# EAGLE design Schalter-UB-HF-Verst2_2 (EAGLE 6.2)
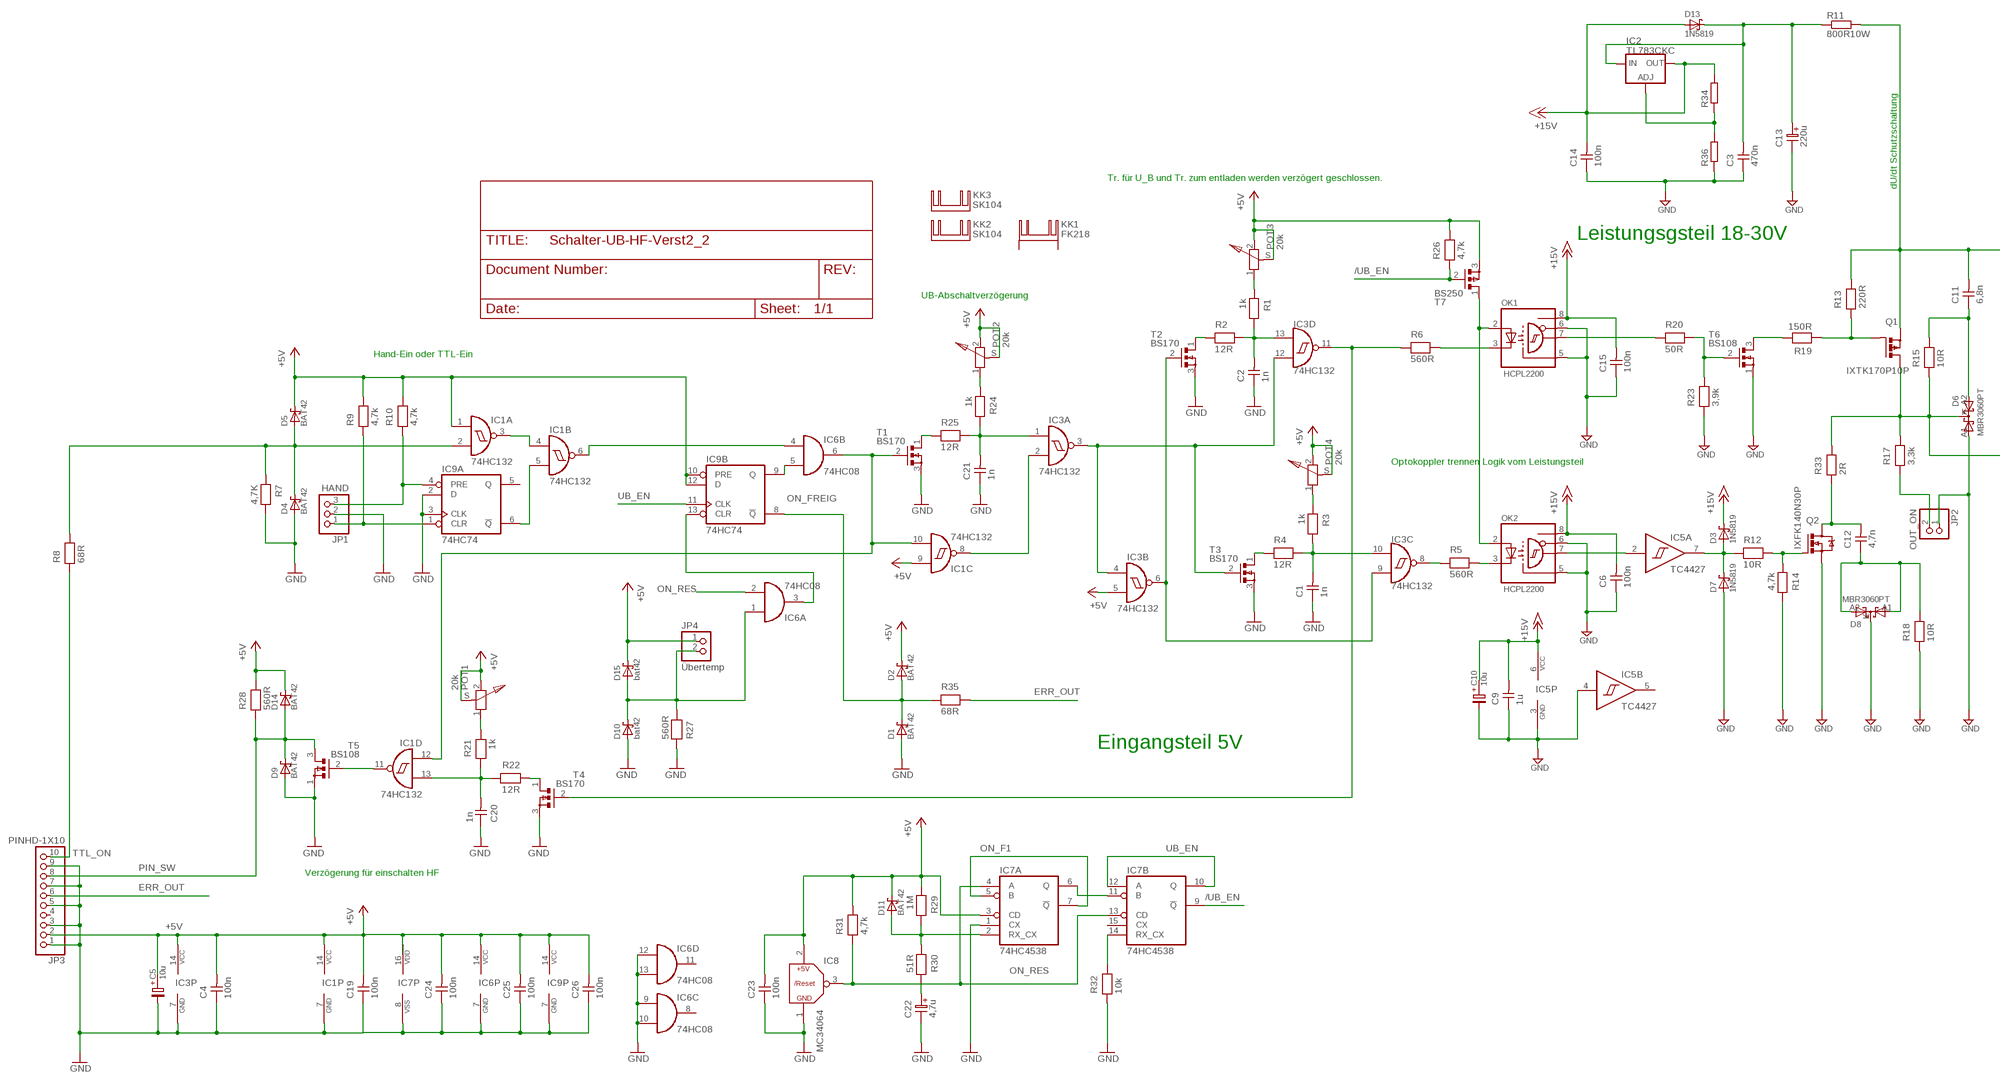
[diagram p0: schematic, sheet 1, part 1 of 2]
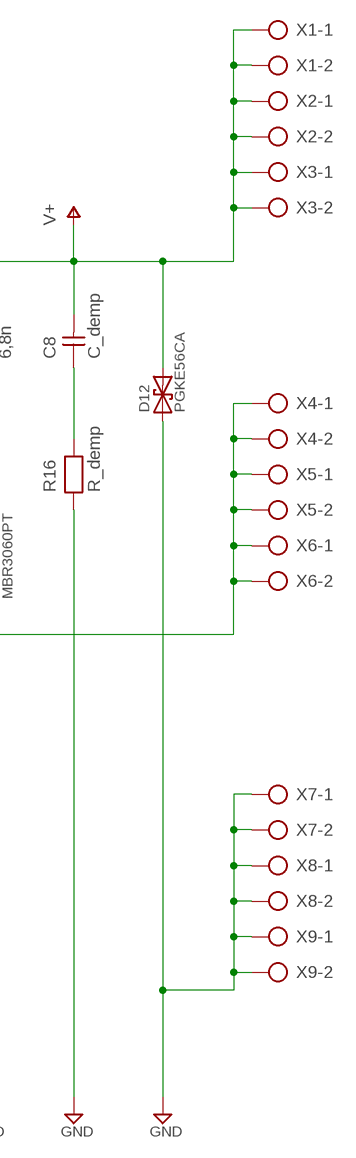
[diagram p1: schematic, sheet 1, part 2 of 2]

## Parts
C1  1n  CAPNP-2,5  [C-2,5]
C2  1n  CAPNP-2,5  [C-2,5]
C3  470n  CAPNP-5  [C-5]
C4  100n  CAPNP-2,5  [C-2,5]
C5  10u  B45181A  [B45181A]
C6  100n  CAPNP-2,5  [C-2,5]
C8  C_demp  CAPNP-7,5  [C-7,5]
C9  1u  CAPNP-5  [C-5]
C10  10u  B45181A  [B45181A]
C11  6,8n  CAPNP-10  [C-10]
C12  4,7n  CAPNP-10  [C-10]
C13  220u  ELC-5  [ES-5]
C14  100n  CAPNP-2,5  [C-2,5]
C15  100n  CAPNP-2,5  [C-2,5]
C19  100n  CAPNP-2,5  [C-2,5]
C20  1n  CAPNP-2,5  [C-2,5]
C21  1n  CAPNP-2,5  [C-2,5]
C22  4,7u  ELC-2,5  [ES-2,5]
C23  100n  CAPNP-2,5  [C-2,5]
C24  100n  CAPNP-2,5  [C-2,5]
C25  100n  CAPNP-2,5  [C-2,5]
C26  100n  CAPNP-2,5  [C-2,5]
D1  BAT42  SCHOTTKY-5  [D-5]
D2  BAT42  SCHOTTKY-5  [D-5]
D3  1N5819  1N5919  [F-126-10]
D4  BAT42  SCHOTTKY-5  [D-5]
D5  BAT42  SCHOTTKY-5  [D-5]
D6  MBR3060PT  PBYR6045  [SOT93S]
D7  1N5819  1N5919  [F-126-10]
D8  MBR3060PT  PBYR3035  [SOT93S]
D9  BAT42  SCHOTTKY-5  [D-5]
D10  bat42  SCHOTTKY-5  [D-5]
D11  BAT42  SCHOTTKY-5  [D-5]
D12  PGKE56CA  P6KEXXC  [CB417-15]
D13  1N5819  [F126-10]
D14  BAT42  SCHOTTKY-5  [D-5]
D15  bat42  SCHOTTKY-5  [D-5]
IC1  74HC132  74132  [DIL14]
IC2  TL783CKC  LM138-TS  [TO220S]
IC3  74HC132  74132  [DIL14]
IC5  TC4427  [DIL08]
IC6  74HC08  7408  [DIL14]
IC7  74HC4538  4538  [DIL16]
IC8  MC34064  TL7757  [TO92]
IC9  74HC74  7474  [DIL14]
JP1  HAND  PINHD-1X3  [1X03]
JP2  OUT_ON  PINHD-1X2  [1X02]
JP3  PINHD-1X10  [1X10]
JP4  Übertemp  PINHD-1X2  [1X02]
KK1  FK218  [FK218]
KK2  SK104  [SK104]
KK3  SK104  [SK104]
OK1  HCPL2200  [DIL08]
OK2  HCPL2200  [DIL08]
POT1  20k  POT-10-SI  [PT-10-SI]
POT2  20k  POT-10-SI  [PT-10-SI]
POT3  20k  POT-10-SI  [PT-10-SI]
POT4  20k  POT-10-SI  [PT-10-SI]
Q1  IXTK170P10P  PMOSFET_PTO220BV  [TO220BV]
Q2  IXFK140N30P  IRFPC40  [TO247BV]
R1  1k  RESEU-7,5  [R-7,5]
R2  12R  RESEU-7,5  [R-7,5]
R3  1k  RESEU-7,5  [R-7,5]
R4  12R  RESEU-7,5  [R-7,5]
R5  560R  RESEU-7,5  [R-7,5]
R6  560R  RESEU-7,5  [R-7,5]
R7  4,7K  RESEU-7,5  [R-7,5]
R8  68R  RESEU-7,5  [R-7,5]
R9  4,7k  RESEU-7,5  [R-7,5]
R10  4,7k  RESEU-7,5  [R-7,5]
R11  800R10W  R-EU_0817/7V  [P0817V]
R12  10R  RESEU-7,5  [R-7,5]
R13  220R  RESEU-25  [R25]
R14  4,7k  RESEU-7,5  [R-7,5]
R15  10R  RESEU-12,5  [R-12,5]
R16  R_demp  RESEU-12,5  [R-12,5]
R17  3,3k  RESEU-12,5  [R-12,5]
R18  10R  RESEU-12,5  [R-12,5]
R19  150R  RESEU-12,5  [R-12,5]
R20  50R  RESEU-7,5  [R-7,5]
R21  1k  RESEU-7,5  [R-7,5]
R22  12R  RESEU-7,5  [R-7,5]
R23  3,9k  RESEU-7,5  [R-7,5]
R24  1k  RESEU-7,5  [R-7,5]
R25  12R  RESEU-7,5  [R-7,5]
R26  4,7k  RESEU-7,5  [R-7,5]
R27  560R  RESEU-7,5  [R-7,5]
R28  560R  RESEU-7,5  [R-7,5]
R29  1M  RESEU-7,5  [R-7,5]
R30  51R  RESEU-7,5  [R-7,5]
R31  4,7k  RESEU-S2,5  [RS-2,5]
R32  10k  RESEU-7,5  [R-7,5]
R33  2R  R-TO220  [R-TO220]
R34  R-EU_0204/7  [0204/7]
R35  68R  RESEU-7,5  [R-7,5]
R36  R-EU_0204/7  [0204/7]
T1  BS170  [TO-92]
T2  BS170  [TO-92]
T3  BS170  [TO-92]
T4  BS170  [TO-92]
T5  BS108  [TO92-]
T6  BS108  [TO92-]
T7  BS250  [TO-92]
X1  AK500/2  [AK500/2]
X2  AK500/2  [AK500/2]
X3  AK500/2  [AK500/2]
X4  AK500/2  [AK500/2]
X5  AK500/2  [AK500/2]
X6  AK500/2  [AK500/2]
X7  AK500/2  [AK500/2]
X8  AK500/2  [AK500/2]
X9  AK500/2  [AK500/2]

## Nets
+5V: C4.2 C5.+ C19.2 C23.2 C24.2 C25.2 C26.2 D2.2(K) D5.2(K) D11.2(K) D14.2(K) D15.2(K) IC1.1(A:I0) IC1.9(C:I0) IC1.14(P:VCC) IC3.5(B:I1) IC3.14(P:VCC) IC6.14(P:VCC) IC7.3(A:CD) IC7.16(P:VDD) IC8.2(+5V) IC9.10(B:PRE) IC9.12(B:D) IC9.14(P:VCC) JP3.2 JP4.1 POT1.2 POT1.S POT2.2 POT2.S POT3.2 POT3.S POT4.2 POT4.S R9.2 R10.2 R26.2 R28.2 R29.1 R31.2 T7.3(S)
+15V: C6.2 C9.2 C10.+ C14.2 C15.2 D3.K D13.A IC2.2(OUT) IC5.6(P:VCC) OK1.8(VCC) OK2.8(VCC) R34.2
/UB_EN: IC7.9(B:!Q) R26.1 T7.2(G)
ERR_OUT: JP3.6 R35.2
GND: C1.1 C2.1 C4.1 C5.- C19.1 C20.1 C21.1 C22.2 C23.1 C24.1 C25.1 C26.1 D1.1(A) D4.1(A) D9.1(A) D10.1(A) IC1.7(P:GND) IC3.7(P:GND) IC6.7(P:GND) IC6.9(C:I0) IC6.10(C:I1) IC6.12(D:I0) IC6.13(D:I1) IC7.1(A:CX) IC7.8(P:VSS) IC8.1(GND) IC9.2(A:D) IC9.3(A:CLK) IC9.7(P:GND) JP1.2 JP3.1 JP3.3 JP3.5 JP3.7 JP3.9 R7.2 R27.1 R32.1 T1.3(S) T2.3(S) T3.3(S) T4.3(S) T5.1(S)
GND-PWR: C3.1 C6.1 C9.1 C10.- C13.2 C14.1 C15.1 D6.A1 D7.A D8.K D12.A IC5.3(P:GND) IC5.4(B:I) JP2.1 OK1.5(GND) OK1.6(VE) OK2.5(GND) OK2.6(VE) Q2.S R14.2 R16.1 R18.1 R23.1 R36.1 T6.1(S) X7.1 X7.2 X8.1 X8.2 X9.1 X9.2 ; supply symbol labelled GND
HAND_OFF: IC9.4(A:PRE) JP1.3 R10.1
HAND_ON: IC9.1(A:CLR) JP1.1 R9.1
N$1: C1.2 IC3.10(C:I1) R3.2 R4.2
N$2: IC3.6(B:O) IC3.9(C:I0) T2.2(G)
N$3: R2.1 T2.1(D)
N$4: C2.2 IC3.13(D:I1) R1.2 R2.2
N$5: IC1.3(A:O) IC1.4(B:I0)
N$6: IC6.3(A:O) IC9.13(B:CLR)
N$7: R4.1 T3.1(D)
N$8: IC2.1(ADJ) R34.1 R36.2
N$9: OK1.3(K) R6.2
N$10: IC3.11(D:O) R6.1 T4.2(G)
N$11: OK2.3(K) R5.2
N$12: IC3.8(C:O) R5.1
N$13: D3.A D7.K IC5.7(A:O) R12.1
N$14: D1.2(K) D2.1(A) IC9.8(B:!Q) R35.1
N$15: D4.2(K) D5.1(A) IC1.2(A:I1) R7.1 R8.2
N$16: IC1.6(B:O) IC6.4(B:I0)
N$17: Q2.G R12.2 R14.1
N$18: C8.1 R16.2
N$19: JP2.2 R17.1
N$20: POT3.1 R1.1
N$21: IC1.11(D:O) T5.2(G)
N$22: R20.2 R23.2 T6.2(G)
N$24: IC5.2(A:I) OK2.7(VO)
N$25: C20.2 IC1.13(D:I1) R21.2 R22.2
N$26: Q1.G R13.1 R19.1
N$27: C11.1 D6.A2 R15.2
N$30: R19.2 T6.3(D)
N$31: C12.2 Q2.D R33.1
N$32: POT4.1 R3.1
N$33: C12.1 D8.A1 D8.A2 R18.2
N$34: IC1.8(C:O) IC3.2(A:I1)
N$35: IC3.3(A:O) IC3.4(B:I0) IC3.12(D:I0) T3.2(G)
N$36: IC1.5(B:I1) IC9.6(A:!Q)
N$37: IC1.10(C:I1) IC1.12(D:I0) IC6.6(B:O) T1.2(G)
N$38: R22.1 T4.1(D)
N$39: OK1.7(VO) R20.1
N$40: POT2.1 R24.1
N$41: C21.2 IC3.1(A:I0) R24.2 R25.2
N$42: R25.1 T1.1(D)
N$43: IC7.6(A:Q) IC7.11(B:B)
N$44: OK1.2(A) OK2.2(A) T7.1(D)
N$45: POT1.1 R21.1
N$46: C22.1 R30.2
N$47: D11.1(A) IC7.2(A:RX_CX) R29.2 R30.1
N$48: IC7.14(B:RX_CX) R32.2
ON_F1: IC7.5(A:B) IC7.7(A:!Q)
ON_FREIG: IC6.5(B:I1) IC9.9(B:Q)
ON_RES: IC6.2(A:I1) IC7.4(A:A) IC7.13(B:CD) IC8.3(/RESET) R31.1
OUT: D6.K Q1.S R15.1 R17.2 R33.2 X4.1 X4.2 X5.1 X5.2 X6.1 X6.2
PIN_SW: D9.2(K) D14.1(A) JP3.8 R28.1 T5.3(D)
TEMP_OFF: D10.2(K) D15.1(A) IC6.1(A:I0) JP4.2 R27.2
TTL_ON: JP3.10 R8.1
UB_EN: IC7.10(B:Q) IC7.12(B:A) IC9.11(B:CLK)
V+: C8.2 C11.2 D12.K Q1.D R11.2 R13.2 X1.1 X1.2 X2.1 X2.2 X3.1 X3.2
V+_1: C3.2 C13.1 D13.K IC2.3(IN) R11.1
Unconnected: IC5.5(B:O) IC6.8(C:O) IC6.11(D:O) IC7.15(B:CX) IC9.5(A:Q) JP3.4 KK1.A2,2(K) KK1.B2,2(K)

## Notes on the sheet
- dU/dt Schutzschaltung
- Tr. für U_B und Tr. zum entladen werden verzögert geschlossen.
- Leistungsgsteil 18-30V
- UB-Abschaltverzögerung
- Hand-Ein oder TTL-Ein
- Optokoppler trennen Logik vom Leistungsteil
- Eingangsteil 5V
- Verzögerung für einschalten HF

## Library data of the parts
C1 C2 C4 C6 C14 C15 C19-C21 C23-C26 = discrete:CAPNP-2,5
C3 C9 = discrete:CAPNP-5
C5 C10 = cap-tant:B45181A
C8 = discrete:CAPNP-7,5
C11 C12 = discrete:CAPNP-10
C13 = discrete:ELC-5
C22 = discrete:ELC-2,5
D1 D2 D4 D5 D9-D11 D14 D15 = diode:SCHOTTKY-5
D3 D7 = DIODE@2:1N5919
D6 = DIODE@3:PBYR6045
D8 = diode:PBYR3035
D12 = diode:P6KEXXC
D13 = diode:1N5819
IC1 IC3 = 74xx:74132
IC2 = v-reg:LM138-TS: VOLTAGE REGULATOR
IC5 = 74xx:TC4427
IC6 = 74xx:7408
IC7 = 45xx:4538
IC8 = Reset-IC:TL7757
IC9 = 74xx:7474
JP1 = pinhead:PINHD-1X3
JP2 JP4 = pinhead:PINHD-1X2
JP3 = pinhead:PINHD-1X10
KK1 = heatsink:FK218: HEATSINK manufacturer Fischer/distributor Buerklin
KK2 KK3 = heatsink:SK104: HEATSINK manufacturer Fischer/distributor Buerklin
OK1 OK2 = optocpl:HCPL2200
POT1-POT4 = discrete:POT-10-SI
Q1 = transistor-power:PMOSFET_P: Power MOSFET P-Channel
Q2 = transistor-power:IRFPC40: N-CHANNEL MOS FET
R1-R10 R12 R14 R20-R30 R32 R35 = discrete:RESEU-7,5
R11 R34 R36 = rcl:R-EU_: RESISTOR, European symbol
R13 = discrete:RESEU-25
R15-R19 = discrete:RESEU-12,5
R31 = discrete:RESEU-S2,5
R33 = discrete:R-TO220
T1-T4 = fet:BS170
T5 T6 = fet:BS108
T7 = fet:BS250
X1-X9 = klemme-RM-95:AK500/2: CONNECTOR; OC_FARNELL: unknown; OC_NEWARK: unknown

## Board
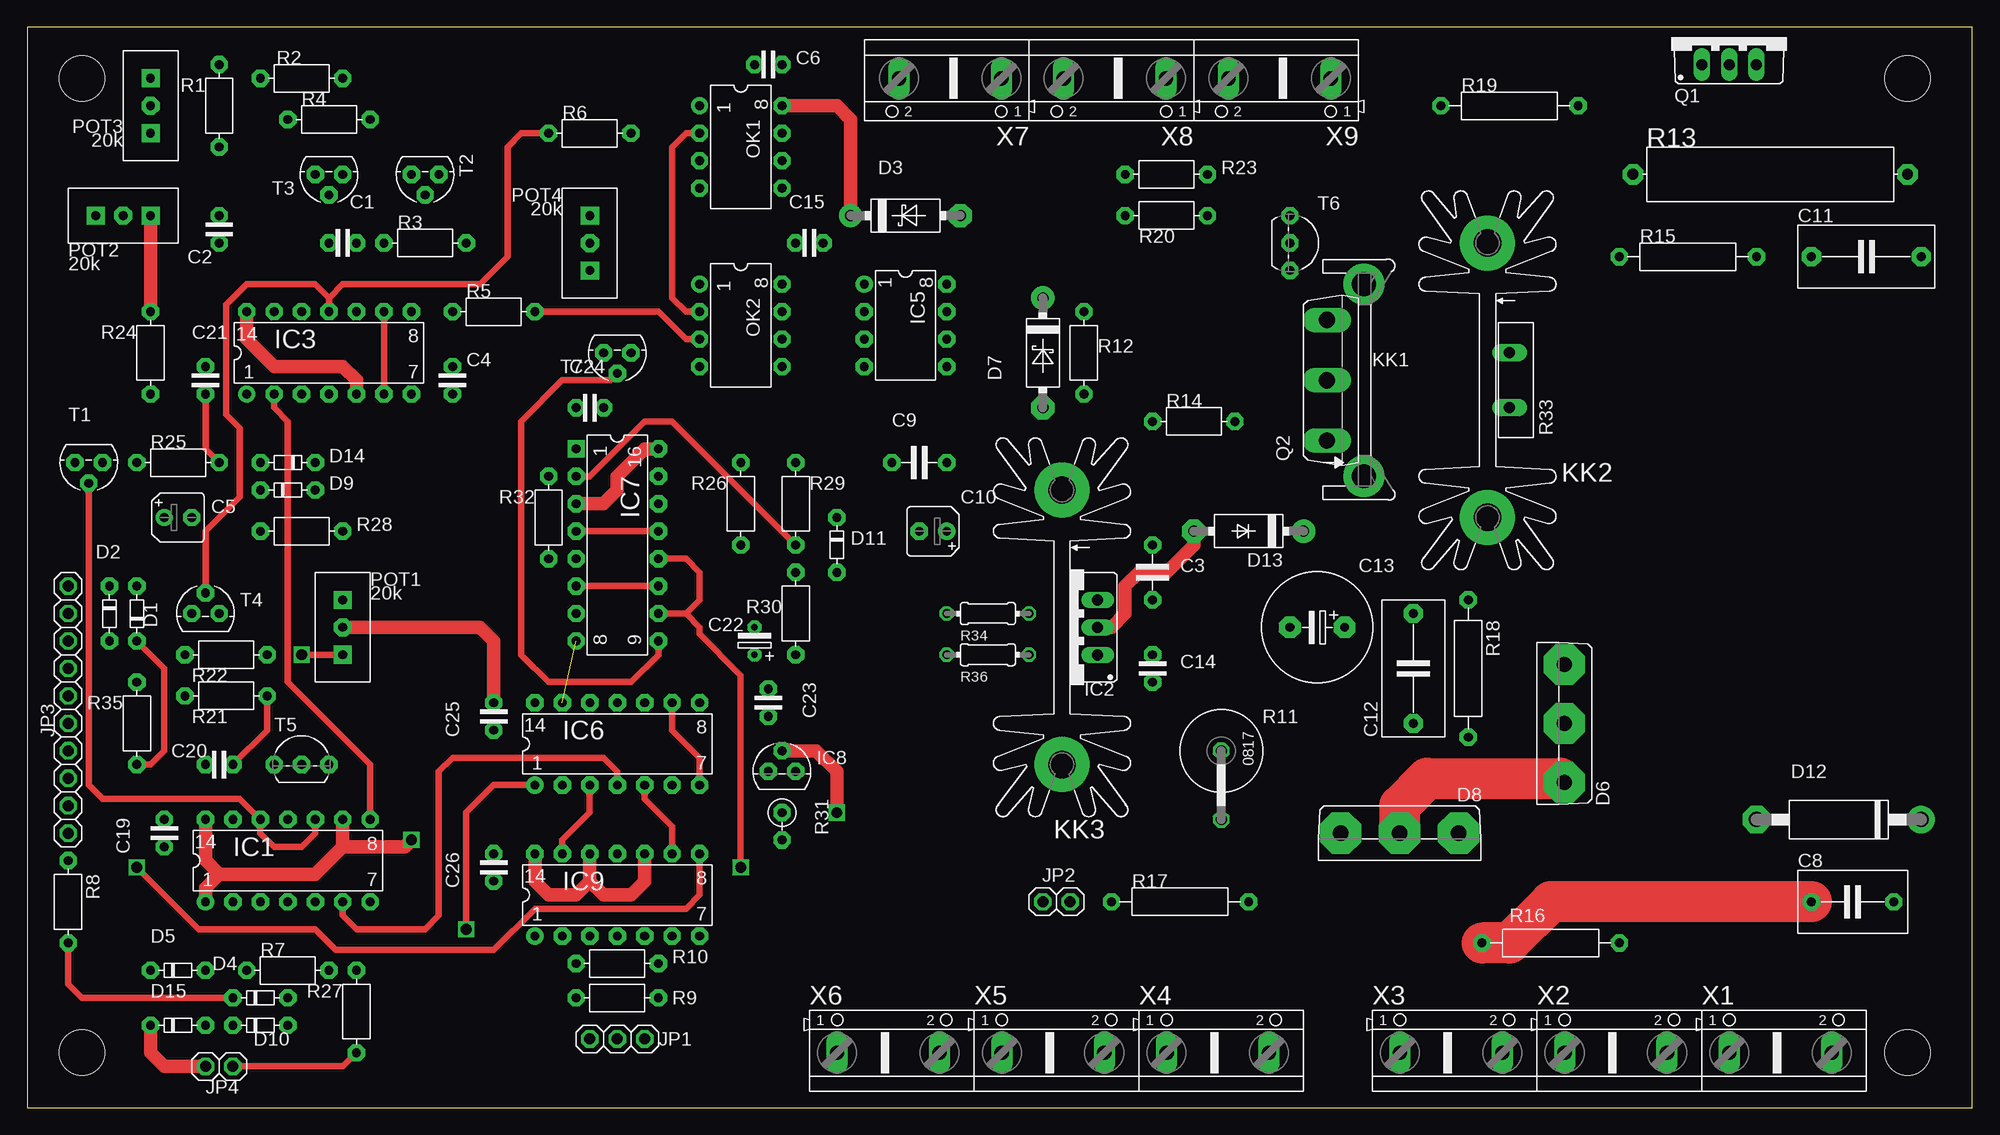
[diagram p2: board, top side]
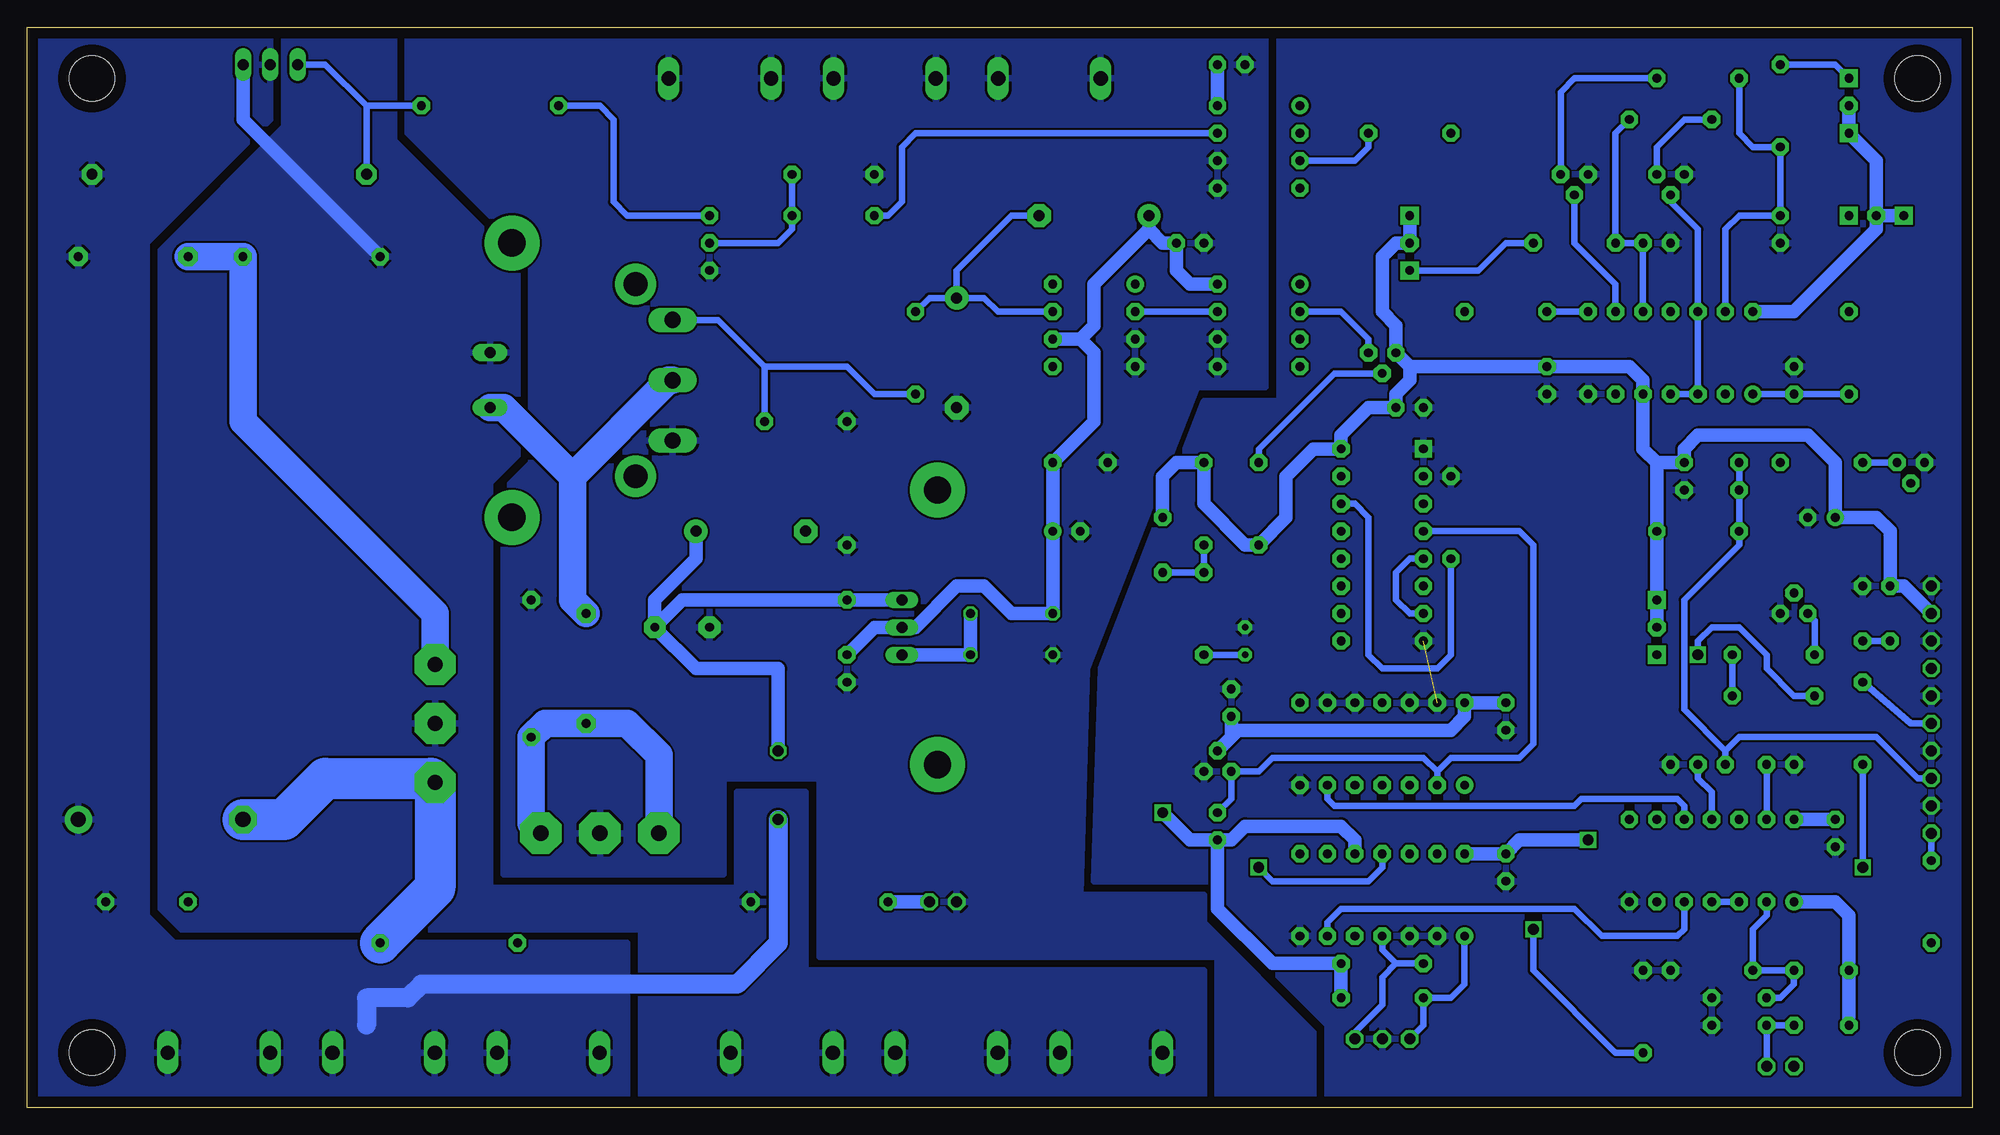
[diagram p3: board, bottom side, seen from below]

Size 180 x 100 mm. Coordinates in mm from the lower left corner, seen from the top.
Outline: 0,0 180,0 180,100 0,100 0,0
Copper layers (1*16): Top 0.035mm / dielectric 1.5mm / Bottom 0.035mm
Design rules: minimum track width 10mil, minimum drill 24mil, track to track 8mil, track to pad 8mil, pad to pad 8mil, via to via 8mil, smd to smd 8mil, copper to edge 40mil, drill to drill 8mil, minimum pad ring 10mil, minimum via ring 8mil, stop-mask expansion 4mil, vias tented up to drill 0mil, thermal gap 10mil
Holes 4.2 mm at 173.99,5.08 173.99,95.25 5.08,95.25 5.08,5.08

### Footprints (pad centres in the part's own frame; a part is rotated, then mirrored left to right if it is on the bottom)
C-2,5 = drill 0.813 pad 1.6 octagon: 1 -1.27,0; 2 1.27,0
C-5 = drill 0.813 pad 1.6 octagon: 1 -2.54,0; 2 2.54,0
B45181A = drill 0.813 pad 1.6: + -1.27,0 | drill 0.813 pad 1.6 octagon: - 1.27,0
C-7,5 = drill 0.813 pad 1.6 octagon: 1 -3.81,0; 2 3.81,0
C-10 = drill 0.813 pad 1.778 octagon: 1 -5.08,0; 2 5.08,0
ES-5 = drill 0.813 pad 2.007 octagon: 1 -2.54,0; 2 2.54,0
ES-2,5 = drill 0.61 pad 1.27 octagon: 1 -1.27,0; 2 1.27,0
D-5 = drill 0.813 pad 1.6 octagon: 1 -2.54,0; 2 2.54,0
F-126-10 = drill 1.016 pad 2.159 octagon: A 5.08,0 | drill 1.016 pad 2.159: K -5.08,0
SOT93S = drill 1.397 pad 3.81 octagon: A1 -5.461,-2.54; A2 5.461,-2.54; K 0,-2.54
CB417-15 = drill 1.397 pad 2.54 octagon: A 7.62,0 | drill 1.397 pad 2.54: K -7.62,0
F126-10 = drill 1.016 pad 2.159 octagon: A 5.08,0 | drill 1.016 pad 2.159: K -5.08,0
DIL14 = drill 0.813 pad 1.6: 1 -7.62,-3.81 | drill 0.813 pad 1.6 octagon: 2 -5.08,-3.81; 3 -2.54,-3.81; 4 0,-3.81; 5 2.54,-3.81; 6 5.08,-3.81; 7 7.62,-3.81; 8 7.62,3.81; 9 5.08,3.81; 10 2.54,3.81; 11 0,3.81; 12 -2.54,3.81; 13 -5.08,3.81; 14 -7.62,3.81
TO220S = drill 1.016 long: 1 -2.54,-2.54; 2 0,-2.54; 3 2.54,-2.54
DIL08 = drill 0.813 pad 1.6: 1 -3.81,-3.81 | drill 0.813 pad 1.6 octagon: 2 -1.27,-3.81; 3 1.27,-3.81; 4 3.81,-3.81; 5 3.81,3.81; 6 1.27,3.81; 7 -1.27,3.81; 8 -3.81,3.81
DIL16 = drill 0.813 pad 1.6 square: 1 -8.89,-3.81 | drill 0.813 pad 1.6 octagon: 2 -6.35,-3.81; 3 -3.81,-3.81; 4 -1.27,-3.81; 5 1.27,-3.81; 6 3.81,-3.81; 7 6.35,-3.81; 8 8.89,-3.81; 9 8.89,3.81; 10 6.35,3.81; 11 3.81,3.81; 12 1.27,3.81; 13 -1.27,3.81; 14 -3.81,3.81; 15 -6.35,3.81; 16 -8.89,3.81
TO92 = drill 0.813 pad 1.6 octagon: 1 1.27,0; 2 0,1.905; 3 -1.27,0
1X03 = drill 1.016 pad 1.6 octagon: 1 -2.54,0; 2 0,0; 3 2.54,0
1X02 = drill 1.016 pad 1.6 octagon: 1 -1.27,0; 2 1.27,0
1X10 = drill 1.016 pad 1.6 octagon: 1 -11.43,0; 2 -8.89,0; 3 -6.35,0; 4 -3.81,0; 5 -1.27,0; 6 1.27,0; 7 3.81,0; 8 6.35,0; 9 8.89,0; 10 11.43,0
FK218 = drill 2.21 pad 3.81: A2,2 -8.89,-0.508; B2,2 8.89,-0.508
SK104 = drill 2.54 pad 5.08: A2,5 -12.7,-0.762; B2,5 12.7,-0.762
PT-10-SI = drill 0.813 pad 1.676 square: 1 -2.54,0; 2 2.54,0 | drill 0.813 pad 1.676 octagon: S 0,0
TO220BV = drill 1.016 long: D 0,-2.54; G -2.54,-2.54; S 2.54,-2.54
TO247BV = drill 1.499 long: D 0,-2.921; G -5.588,-2.921; S 5.588,-2.921
R-7,5 = drill 0.813 pad 1.6 octagon: 1 -3.81,0; 2 3.81,0
P0817V = drill 1.016 octagon: 1 -5.08,0; 2 1.27,0
R25 = drill 1.016 pad 1.905 octagon: 1 -12.7,0; 2 12.7,0
R-12,5 = drill 0.813 pad 1.6 octagon: 1 -6.35,0; 2 6.35,0
RS-2,5 = drill 0.813 pad 1.6 octagon: 1 0,0; 2 2.54,0
R-TO220 = drill 1.016 pad 1.626 long: 1 -2.54,0; 2 2.54,0
0204/7 = drill 0.813 octagon: 1 -3.81,0; 2 3.81,0
TO-92 = drill 0.813 pad 1.6 octagon: 1 -1.27,0; 2 0,1.905; 3 1.27,0
TO92- = drill 0.813 pad 1.6 octagon: 1 2.54,0; 2 0,0; 3 -2.54,0
AK500/2 = drill 1.321 long: 1 0.025,0; 2 9.5,0

### Placement (x,y rotation side)
C1  29.21,80.01 0 top
C2  17.78,81.28 90 top
C3  104.14,49.53 270 top
C4  39.37,67.31 90 top
C5  13.97,54.61 0 top
C6  68.58,96.52 0 top
C8  168.91,19.05 0 top
C9  82.55,59.69 0 top
C10  83.82,53.34 180 top
C11  170.18,78.74 0 top
C12  128.27,40.64 90 top
C13  119.38,44.45 180 top
C14  104.14,40.64 90 top
C15  72.39,80.01 0 top
C19  12.7,25.4 90 top
C20  17.78,31.75 0 top
C21  16.51,67.31 270 top
C22  67.31,43.18 90 top
C23  68.58,37.47 270 top
C24  52.07,64.77 0 top
C25  43.18,36.2 90 top
C26  43.18,22.23 90 top
D1  10.16,45.72 270 top
D2  7.62,45.72 90 top
D3  81.28,82.55 0 top
D4  21.59,10.16 180 top
D5  13.97,12.7 180 top
D6  139.7,35.56 90 top
D7  93.98,69.85 270 top
D8  127,22.86 180 top
D9  24.13,57.15 180 top
D10  21.59,7.62 180 top
D11  74.93,52.07 90 top
D12  167.64,26.67 180 top
D13  113.03,53.34 180 top
D14  24.13,59.69 0 top
D15  13.97,7.62 180 top
IC1  24.13,22.86 0 top
IC2  96.52,44.45 90 top
IC3  27.94,69.85 0 top
IC5  81.28,72.39 270 top
IC6  54.61,33.66 0 top
IC7  54.61,52.07 270 top
IC8  69.85,31.11 0 top
IC9  54.61,19.68 0 top
JP1  54.61,6.35 0 top
JP2  95.25,19.05 0 top
JP3  3.81,36.83 270 top
JP4  17.78,3.81 0 top
KK1  123.19,67.31 90 top
KK2  135.89,67.31 270 top
KK3  96.52,44.45 270 top
OK1  66.04,88.9 270 top
OK2  66.04,72.39 270 top
POT1  29.21,44.45 90 top
POT2  8.89,82.55 180 top
POT3  11.43,92.71 270 top
POT4  52.07,80.01 90 top
Q1  157.48,99.06 0 top
Q2  123.19,67.31 270 top
R1  17.78,92.71 270 top
R2  25.4,95.25 180 top
R3  36.83,80.01 180 top
R4  27.94,91.44 0 top
R5  43.18,73.66 0 top
R6  52.07,90.17 0 top
R7  24.13,12.7 0 top
R8  3.81,19.05 270 top
R9  54.61,10.16 0 top
R10  54.61,13.34 0 top
R11  110.49,27.94 270 top
R12  97.79,69.85 270 top
R13  161.29,86.36 0 top
R14  107.95,63.5 180 top
R15  153.67,78.74 0 top
R16  140.97,15.24 180 top
R17  106.68,19.05 0 top
R18  133.35,40.64 270 top
R19  137.16,92.71 180 top
R20  105.41,82.55 0 top
R21  18.41,38.1 0 top
R22  18.41,41.91 0 top
R23  105.41,86.36 0 top
R24  11.43,69.85 270 top
R25  13.97,59.69 0 top
R26  66.04,55.88 270 top
R27  30.48,8.89 270 top
R28  25.4,53.34 0 top
R29  71.12,55.88 270 top
R30  71.12,45.72 270 top
R31  69.85,27.3 270 top
R32  48.26,54.61 270 top
R33  137.16,67.31 90 top
R34  88.9,45.72 180 top
R35  10.16,35.56 90 top
R36  88.9,41.91 0 top
T1  5.71,59.69 180 top
T2  36.83,86.36 180 top
T3  27.94,86.36 180 top
T4  16.51,45.72 0 top
T5  25.4,31.75 0 top
T6  116.84,80.01 270 top
T7  54.61,69.85 180 top
X1  157.48,5.08 0 top
X2  142.24,5.08 0 top
X3  127,5.08 0 top
X4  105.41,5.08 0 top
X5  90.17,5.08 0 top
X6  74.93,5.08 0 top
X7  90.17,95.25 180 top
X8  105.41,95.25 180 top
X9  120.65,95.25 180 top

### Tracks (layer width: path | path; a pad name or v marks a point on that pad's centre or on a via)
+5V  (via drill 1 pad 0.61)
  Top 1.27: IC7.3 53.34,55.88 54.61,57.15 54.61,58.42 57.15,60.96 IC7.16 | IC9.10 57.15,20.95 55.88,19.68 53.34,19.68 52.07,20.95 | 52.07,20.95 IC9.12 | IC9.14 46.99,20.95 48.26,19.68 50.8,19.68 52.07,20.95 | IC8.2 73.03,33.02 74.93,31.11 v74.93,27.3 | IC3.5 30.48,67.31 29.21,68.58 22.86,68.58 20.32,71.12 IC3.14 | POT1.S 41.91,44.45 43.18,43.18 C25.2 | D15.2 11.43,5.08 12.7,3.81 JP4.1 | IC1.9 29.21,24.13 | 29.21,24.13 34.92,24.13 v35.56,24.77 | 29.21,24.13 26.67,21.59 17.78,21.59 | 17.78,21.59 16.51,20.32 IC1.1 | IC1.14 16.51,22.86 17.78,21.59
  Bottom 1.27: 52.07,68.58 T7.3 53.34,72.39 54.61,73.66 54.61,78.74 53.34,80.01 POT4.S POT4.2 | 52.07,68.58 52.07,67.31 53.34,66.04 C24.2 55.88,64.77 58.42,62.23 IC7.16 60.96,60.96 63.5,58.42 63.5,54.61 R26.2 67.31,52.07 71.12,55.88 R29.1 73.66,59.69 74.93,58.42 D11.2 | C25.2 IC6.14 46.99,36.2 48.26,34.92 67.94,34.92 68.58,34.29 | 68.58,34.29 IC8.2 | C23.2 68.58,34.29 | R31.2 68.58,24.77 67.31,26.04 58.42,26.04 57.15,24.77 IC9.10 | IC9.14 C26.2 41.91,24.77 v35.56,24.77 | R31.2 69.85,18.41 64.77,13.34 R10.2 R9.2 | v74.93,27.3 72.39,24.77 R31.2 | 52.07,68.58 C4.2 31.75,68.58 30.48,67.31 IC3.5 30.48,60.96 29.21,59.69 | 29.21,59.69 D14.2 26.67,60.96 25.4,62.23 15.24,62.23 12.7,59.69 C5.+ 8.89,54.61 7.62,53.34 D2.2 6.35,48.26 JP3.2 | POT1.S POT1.2 R28.2 29.21,59.69 | POT2.2 POT2.S | POT2.S 8.89,87.63 POT3.2 POT3.S | POT2.S 8.89,81.28 16.51,73.66 IC3.14 | IC1.14 C19.2 | IC1.1 12.7,19.05 11.43,17.78 D5.2 D15.2
+15V
  Top 1.27: D13.A 107.95,52.07 105.41,49.53 102.87,49.53 101.6,48.26 101.6,45.72 100.33,44.45 IC2.2 | OK1.8 74.93,92.71 76.2,91.44 D3.K
  Bottom 1.27: C14.2 101.6,44.45 IC2.2 97.79,44.45 93.98,48.26 91.44,48.26 88.9,45.72 R34.2 C10.+ C9.2 81.28,63.5 81.28,69.85 82.55,71.12 | C6.2 OK1.8 | 76.2,81.28 74.93,80.01 C15.2 73.66,77.47 72.39,76.2 OK2.8 | D3.K 76.2,81.28 | 76.2,81.28 81.28,76.2 81.28,72.39 82.55,71.12 | IC5.6 82.55,71.12
/UB_EN
  Top 0.61: IC7.9 58.42,41.91 55.88,39.37 48.26,39.37 45.72,41.91 45.72,63.5 49.53,67.31 53.98,67.31 T7.2
  Bottom 0.61: T7.2 59.05,67.94 66.04,60.96 R26.1
ERR_OUT
  Bottom 0.61: JP3.6 5.71,35.56 R35.2
GND  (1 unrouted)
  Top 0.61: IC6.9 59.69,34.92 62.23,32.38 IC6.7
  pour Bottom: 69.85,17.78 59.69,7.62 59.69,0 0,0 0,100.33 64.14,100.33 64.14,65.41 71.12,65.41 80.64,40.64 81.28,20.95 69.85,20.95
GND-PWR
  Top 3.81: D8.K 127,27.94 129.54,30.48 141.86,30.48 D6.A1
  Bottom 3.81: R16.1 142.24,20.32 D6.A1 142.62,30.48 152.4,30.48 156.21,26.67 D12.A
  pour Bottom: 60.96,0 60.96,6.99 71.12,17.14 71.12,19.68 82.55,19.68 81.92,40.64 71.75,66.67 65.41,66.67 65.41,100.33 144.78,100.33 144.78,90.17 133.35,78.74 133.35,59.69 135.89,57.15 135.89,21.59 115.57,21.59 115.57,30.48 106.68,30.48 106.68,13.97 69.85,13.97 69.85,0
HAND_OFF
  Bottom 0.61: IC9.4 54.61,14.61 53.34,13.34 | R10.1 53.34,13.34 | 53.34,13.34 54.61,12.06 54.61,9.53 57.15,6.99 JP1.3
HAND_ON
  Bottom 0.61: JP1.1 50.8,7.62 R9.1 48.26,10.16 46.99,11.43 IC9.1
N$1
  Bottom 0.61: IC3.10 C1.2 R3.2 33.02,90.17 R4.2
N$2
  Top 0.61: IC3.9 IC3.6
  Bottom 0.61: T2.2 36.83,80.01 33.02,76.2 IC3.9
N$3
  Bottom 0.61: R2.1 36.83,95.25 38.1,93.98 T2.1
N$4
  Bottom 0.61: R2.2 21.59,90.17 20.32,88.9 R1.2 C2.2 21.59,82.55 22.86,81.28 IC3.13
N$5
  Bottom 0.61: IC1.4 IC1.3
N$6
  Top 0.61: IC6.3 52.07,27.3 49.53,24.77 IC9.13
N$7
  Bottom 0.61: R4.1 26.67,91.44 29.21,88.9 T3.1
N$8
  Bottom 1.27: IC2.1 R36.2 R34.1
N$9
  Bottom 0.61: OK1.3 57.15,87.63 55.88,88.9 R6.2
N$10
  Top 0.61: IC3.11 27.94,74.93 | 27.94,74.93 29.21,76.2 41.91,76.2 44.45,78.74 44.45,88.9 45.72,90.17 R6.1 | T4.2 16.51,53.34 19.68,56.52 19.68,62.87 18.41,64.14 18.41,74.3 20.32,76.2 26.67,76.2 27.94,74.93
N$11
  Top 0.61: R5.2 58.42,73.66 60.96,71.12 OK2.3
N$12
  Bottom 0.61: R5.1 IC3.8
N$13
  Bottom 0.61: IC5.7 90.17,73.66 91.44,74.93 D7.K | D7.K 96.52,74.93 R12.1 | D3.A 88.9,82.55 93.98,77.47 D7.K
N$14  (via drill 1 pad 0.61)
  Top 0.61: v10.16,22.23 15.88,16.51 26.67,16.51 28.57,14.61 43.18,14.61 46.99,18.41 60.96,18.41 62.23,19.68 IC9.8 | D1.2 12.7,40.64 12.7,33.02 11.43,31.75 R35.1
  Bottom 0.61: D1.2 D2.1 | v10.16,22.23 R35.1
N$15
  Top 0.61: R8.2 3.81,11.43 5.08,10.16 D4.2
  Bottom 0.61: IC1.2 19.05,17.78 20.32,16.51 R7.1 D5.1 16.51,11.43 17.78,10.16 D4.2
N$16
  Top 0.61: IC6.4 54.61,31.11 53.34,32.38 39.37,32.38 38.1,31.11 38.1,17.78 36.83,16.51 30.48,16.51 29.21,17.78 IC1.6
N$17
  Bottom 0.61: Q2.G 116.08,72.9 111.76,68.58 | 111.76,68.58 R14.1 | 111.76,68.58 104.14,68.58 101.6,66.04 R12.2
N$18
  Top 3.81: C8.1 140.97,19.05 137.16,15.24 R16.2
N$19
  Bottom 1.27: JP2.2 R17.1
N$20
  Bottom 0.61: POT3.1 12.7,96.52 R1.1
N$21
  Bottom 0.61: T5.2 25.4,30.48 24.13,29.21 IC1.11
N$22
  Bottom 0.61: T6.2 110.49,80.01 109.22,81.28 R20.2 R23.2
N$24
  Bottom 0.61: IC5.2 OK2.7
N$25
  Top 0.61: C20.2 22.23,34.92 R21.2
  Bottom 0.61: C20.2 IC1.13 | R21.2 R22.2
N$26
  Bottom 0.61: Q1.G 152.4,96.52 148.59,92.71 | 148.59,92.71 R19.1 | 148.59,92.71 R13.1
N$27
  Bottom 2.54: D6.A2 142.24,45.72 160.02,63.5 R15.2 C11.1
N$30
  Bottom 0.61: R19.2 127,92.71 125.73,91.44 125.73,83.82 124.46,82.55 T6.3
N$31
  Bottom 2.54: R33.1 135.89,64.77 129.54,58.42 | 129.54,58.42 129.54,46.99 C12.2 | Q2.D 120.65,67.31 129.54,58.42
N$32
  Bottom 0.61: POT4.1 45.72,77.47 43.18,80.01 R3.1
N$33
  Bottom 2.54: D8.A2 121.54,32.64 124.46,35.56 C12.1 132.08,35.56 R18.2 133.35,26.29 D8.A1
N$34
  Top 0.61: IC3.2 22.86,64.77 24.13,63.5 24.13,39.37 31.75,31.75 IC1.8
N$35
  Bottom 0.61: T3.2 27.94,83.82 25.4,81.28 IC3.12 IC3.3 IC3.4
N$36
  Bottom 0.61: IC1.5 26.67,16.51 27.3,15.88 34.29,15.88 36.83,18.41 58.42,18.41 59.69,17.14 IC9.6
N$37
  Top 0.61: T1.2 5.71,29.84 6.99,28.57 19.68,28.57 IC1.12 21.59,25.4 22.86,24.13 25.4,24.13 26.67,25.4 IC1.10
  Bottom 0.61: IC6.6 59.69,28.57 59.05,27.94 36.83,27.94 36.2,28.57 27.3,28.57 26.67,27.94 IC1.10
N$38
  Bottom 0.61: R22.1 14.61,45.09 T4.1
N$39
  Bottom 0.61: R20.1 100.33,82.55 99.06,83.82 99.06,88.9 97.79,90.17 OK1.7
N$40
  Top 1.27: POT2.1 R24.1
N$41
  Top 0.61: C21.2 16.51,60.96 R25.2
  Bottom 0.61: R24.2 C21.2 IC3.1
N$42
  Bottom 0.61: T1.1 R25.1
N$43
  Top 0.61: IC7.6 IC7.11
N$44
  Top 0.61: OK1.2 60.96,90.17 59.69,88.9 59.69,74.93 60.96,73.66 OK2.2
  Bottom 0.61: OK2.2 58.42,73.66 55.88,71.12 T7.1
N$45  (via drill 1 pad 0.61)
  Top 0.61: POT1.1 v25.4,41.91
  Bottom 0.61: v25.4,41.91 25.4,43.18 24.13,44.45 21.59,44.45 19.05,41.91 19.05,40.64 16.51,38.1 R21.1
N$46
  Bottom 0.61: C22.1 R30.2
N$47
  Top 0.61: IC7.2 52.07,58.42 57.15,63.5 59.69,63.5 R29.2
  Bottom 0.61: D11.1 R30.1 R29.2
N$48
  Bottom 0.61: IC7.14 57.15,55.88 55.88,54.61 55.88,41.91 54.61,40.64 49.53,40.64 48.26,41.91 R32.2
ON_F1
  Bottom 0.61: IC7.5 52.07,50.8 53.34,49.53 53.34,46.99 52.07,45.72 IC7.7
ON_FREIG
  Top 0.61: IC6.5 57.15,28.57 59.69,26.04 IC9.9
ON_RES
  Top 0.61: IC7.4 IC7.13
  Bottom 0.61: IC6.2 49.53,31.11 | 49.53,31.11 48.26,32.38 41.91,32.38 40.64,33.66 40.64,52.07 41.91,53.34 IC7.4 | R31.1 68.58,28.57 IC8.3 66.04,31.11 64.77,32.38 50.8,32.38 49.53,31.11
OUT
  Bottom 1.27: Q1.S 160.02,91.44 R15.1
  pour Bottom: 156.21,100.33 156.21,90.81 167.64,79.38 167.64,18.41 165.74,16.51 123.19,16.51 123.19,0 71.12,0 71.12,12.7 107.95,12.7 107.95,29.21 114.3,29.21 114.3,20.32 137.16,20.32 137.16,57.78 134.62,60.33 134.62,78.11 146.05,89.53 146.05,100.33
PIN_SW
  Bottom 0.61: D14.1 D9.2 R28.1 21.59,52.07 26.67,46.99 26.67,36.83 22.86,33.02 | 22.86,33.02 T5.3 | JP3.8 5.08,30.48 8.89,34.29 21.59,34.29 22.86,33.02
TEMP_OFF  (via drill 1 pad 0.61)
  Top 0.61: JP4.2 29.21,3.81 R27.2 | v40.64,16.51 40.64,27.3 43.18,29.84 IC6.1
  Bottom 0.61: D15.1 D10.2 JP4.2 | v40.64,16.51 40.64,12.7 33.02,5.08 R27.2
TTL_ON
  Bottom 0.61: JP3.10 R8.1
UB_EN  (via drill 1 pad 0.61)
  Top 0.61: 60.96,45.72 62.23,44.45 62.23,43.81 66.04,40.01 v66.04,22.23 | 60.96,45.72 IC7.10 | IC7.12 60.96,50.8 62.23,49.53 62.23,46.99 60.96,45.72
  Bottom 0.61: IC9.11 54.61,22.23 55.88,20.95 64.77,20.95 v66.04,22.23
V+
  Bottom 1.778: R11.2 110.49,15.24 114.3,11.43 143.51,11.43 144.78,10.16 148.59,10.16 148.59,7.62
  pour Bottom: 157.48,100.33 157.48,91.44 168.91,80.01 168.91,17.78 166.37,15.24 124.46,15.24 124.46,0 180.34,0 180.34,100.33
V+_1
  Bottom 1.27: D13.K 118.11,50.8 121.92,46.99 C13.1 | C13.1 118.11,40.64 110.49,40.64 R11.1 | IC2.3 C3.2 119.38,46.99 C13.1